# EAGLE design RGB-driver-v1 (EAGLE 7.1.0)
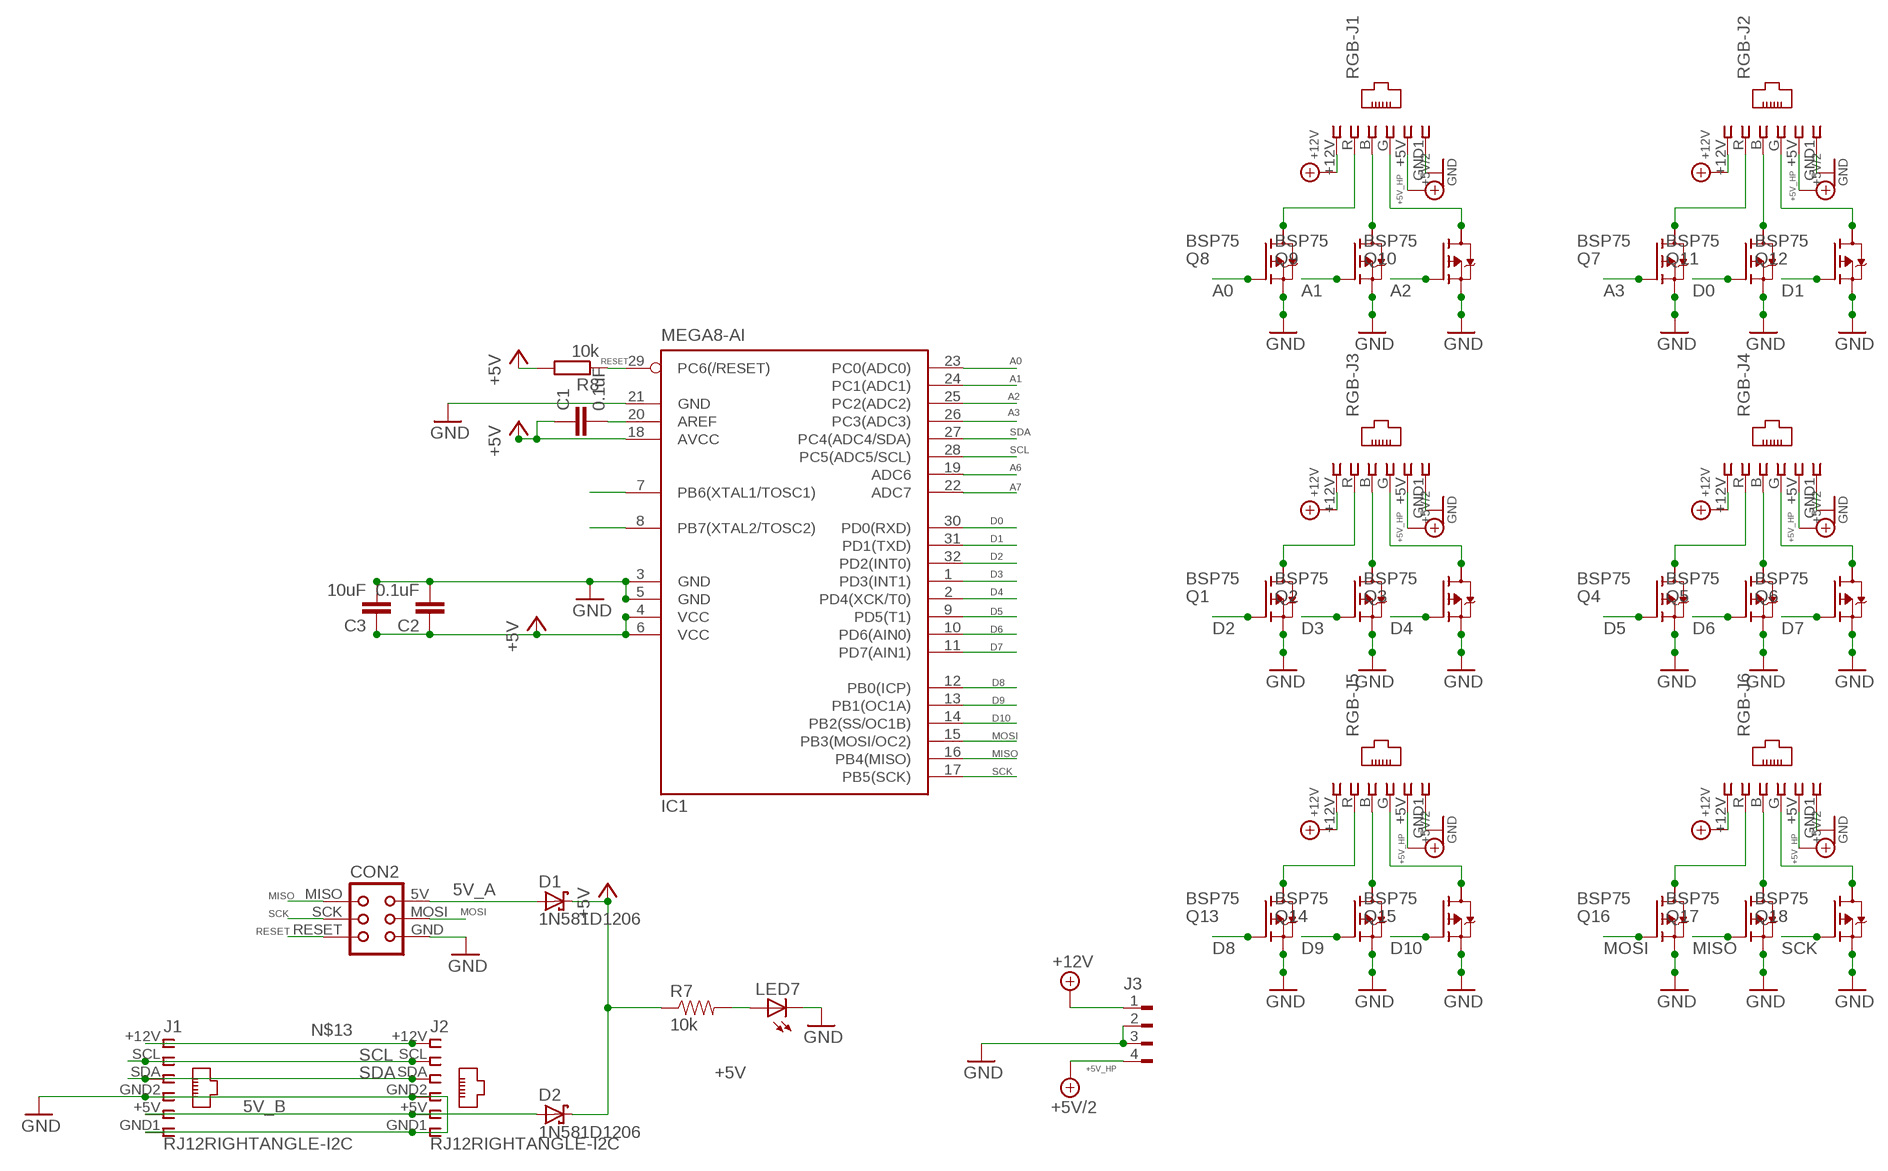
[diagram p0: schematic, sheet 1]

## Parts
C1  0.1uF  C-EUC1206  [C1206]
C2  0.1uF  C-EUC1206  [C1206]
C3  10uF  C-EUC1206  [C1206]
CON2  TINYISPTAG  [TC2030-MCP]
D1  1N581D1206  [LED-1206]
D2  1N581D1206  [LED-1206]
IC1  MEGA8-AI  [TQFP32-08]
J1  RJ12RIGHTANGLE-I2C  [RJ12-RIGHTANGLE-I2C]
J2  RJ12RIGHTANGLE-I2C  [RJ12-RIGHTANGLE-I2C]
J3  FLOP-4W827001  [827001]
LED7  LEDCHIP-LED0603  [CHIP-LED0603]
Q1  BSP75  BSP613P  [PG-SOT-223]
Q2  BSP75  BSP613P  [PG-SOT-223]
Q3  BSP75  BSP613P  [PG-SOT-223]
Q4  BSP75  BSP613P  [PG-SOT-223]
Q5  BSP75  BSP613P  [PG-SOT-223]
Q6  BSP75  BSP613P  [PG-SOT-223]
Q7  BSP75  BSP613P  [PG-SOT-223]
Q8  BSP75  BSP613P  [PG-SOT-223]
Q9  BSP75  BSP613P  [PG-SOT-223]
Q10  BSP75  BSP613P  [PG-SOT-223]
Q11  BSP75  BSP613P  [PG-SOT-223]
Q12  BSP75  BSP613P  [PG-SOT-223]
Q13  BSP75  BSP613P  [PG-SOT-223]
Q14  BSP75  BSP613P  [PG-SOT-223]
Q15  BSP75  BSP613P  [PG-SOT-223]
Q16  BSP75  BSP613P  [PG-SOT-223]
Q17  BSP75  BSP613P  [PG-SOT-223]
Q18  BSP75  BSP613P  [PG-SOT-223]
R7  10k  RESISTOR0603-RES  [0603-RES]
R8  10k  R-EU_M1206  [M1206]
RGB-J1  RJ12  RJ12STRAIGHT-RGB  [RJ12-STRAIGHT-RGB]
RGB-J2  RJ12  RJ12STRAIGHT-RGB  [RJ12-STRAIGHT-RGB]
RGB-J3  RJ12  RJ12STRAIGHT-RGB  [RJ12-STRAIGHT-RGB]
RGB-J4  RJ12  RJ12STRAIGHT-RGB  [RJ12-STRAIGHT-RGB]
RGB-J5  RJ12  RJ12STRAIGHT-RGB  [RJ12-STRAIGHT-RGB]
RGB-J6  RJ12  RJ12STRAIGHT-RGB  [RJ12-STRAIGHT-RGB]

## Nets
5V_A [i2c]: CON2.5V(VCC) D1.A
5V_B [power]: D2.A J1.+5V J2.+5V
+5V [power]: C1.1 C2.1 C3.1 D1.C D2.C IC1.4(VCC) IC1.6(VCC) IC1.18(AVCC) R7.1 R8.2
+5V_HP [power]: J3.4 RGB-J1.+5V RGB-J2.+5V RGB-J3.+5V RGB-J4.+5V RGB-J5.+5V RGB-J6.+5V ; supply symbol labelled +5V/2
+12V_HP [power]: J3.1 RGB-J1.+12V RGB-J2.+12V RGB-J3.+12V RGB-J4.+12V RGB-J5.+12V RGB-J6.+12V ; supply symbol labelled +12V
A0: IC1.23(PC0(ADC0)) Q8.1(G)
A1: IC1.24(PC1(ADC1)) Q9.1(G)
A2: IC1.25(PC2(ADC2)) Q10.1(G)
A3: IC1.26(PC3(ADC3)) Q7.1(G)
A6: IC1.19(ADC6)
A7: IC1.22(ADC7)
D0: IC1.30(PD0(RXD)) Q11.1(G)
D1: IC1.31(PD1(TXD)) Q12.1(G)
D2: IC1.32(PD2(INT0)) Q1.1(G)
D3: IC1.1(PD3(INT1)) Q2.1(G)
D4: IC1.2(PD4(XCK/T0)) Q3.1(G)
D5: IC1.9(PD5(T1)) Q4.1(G)
D6: IC1.10(PD6(AIN0)) Q5.1(G)
D7: IC1.11(PD7(AIN1)) Q6.1(G)
D8: IC1.12(PB0(ICP)) Q13.1(G)
D9: IC1.13(PB1(OC1A)) Q14.1(G)
D10: IC1.14(PB2(SS/OC1B)) Q15.1(G)
GND [power]: C2.2 C3.2 CON2.GND IC1.3(GND) IC1.5(GND) IC1.21(GND) J1.GND1 J1.GND2 J2.GND1 J2.GND2 J3.2 J3.3 LED7.C Q1.3(S) Q2.3(S) Q3.3(S) Q4.3(S) Q5.3(S) Q6.3(S) Q7.3(S) Q8.3(S) Q9.3(S) Q10.3(S) Q11.3(S) Q12.3(S) Q13.3(S) Q14.3(S) Q15.3(S) Q16.3(S) Q17.3(S) Q18.3(S) RGB-J1.GND1 RGB-J2.GND1 RGB-J3.GND1 RGB-J4.GND1 RGB-J5.GND1 RGB-J6.GND1
MISO: CON2.MISO IC1.16(PB4(MISO)) Q17.1(G)
MOSI: CON2.MOSI IC1.15(PB3(MOSI/OC2)) Q16.1(G)
N$1: Q2.2(D) RGB-J3.B
N$2 [aref]: Q1.2(D) RGB-J3.R
N$3 [aref]: Q3.2(D) RGB-J3.G
N$4: C1.2 IC1.20(AREF)
N$5 [aref]: Q5.2(D) RGB-J4.B
N$6 [aref]: Q10.2(D) RGB-J1.G
N$7 [aref]: Q4.2(D) RGB-J4.R
N$8 [aref]: Q6.2(D) RGB-J4.G
N$9 [aref]: Q14.2(D) RGB-J5.B
N$10: Q11.2(D) RGB-J2.B
N$11 [aref]: Q13.2(D) RGB-J5.R
N$12 [aref]: Q15.2(D) RGB-J5.G
N$13: J1.+12V J2.+12V
N$14 [aref]: Q17.2(D) RGB-J6.B
N$15: LED7.A R7.2
N$16 [aref]: Q16.2(D) RGB-J6.R
N$17 [aref]: Q18.2(D) RGB-J6.G
N$20 [aref]: Q7.2(D) RGB-J2.R
N$23 [aref]: Q12.2(D) RGB-J2.G
N$50 [aref]: Q9.2(D) RGB-J1.B
N$68 [aref]: Q8.2(D) RGB-J1.R
PB6: IC1.7(PB6(XTAL1/TOSC1))
PB7: IC1.8(PB7(XTAL2/TOSC2))
RESET: CON2.RESET IC1.29(PC6(/RESET)) R8.1
SCK: CON2.SCK IC1.17(PB5(SCK)) Q18.1(G)
SCL [i2c]: IC1.28(PC5(ADC5/SCL)) J1.SCL J2.SCL
SDA [i2c]: IC1.27(PC4(ADC4/SDA)) J1.SDA J2.SDA
Unconnected: Q1.4(D) Q2.4(D) Q3.4(D) Q4.4(D) Q5.4(D) Q6.4(D) Q7.4(D) Q8.4(D) Q9.4(D) Q10.4(D) Q11.4(D) Q12.4(D) Q13.4(D) Q14.4(D) Q15.4(D) Q16.4(D) Q17.4(D) Q18.4(D)

## Library data of the parts
C1-C3 = resistor:C-EU: CAPACITOR, European symbol
CON2 = lpatiny:TINYISP: CONNECTOR
D1 D2 = lpatiny:1N581*: 1.0A SCHOTTKY BARRIER RECTIFIER Source: http://www.diodes.com/datasheets/ds23001.pdf
IC1 = atmel:MEGA8: MICROCONTROLLER 8 Kbytes FLASH, 1 kbytes SRAM, 512 bytes EEPROM, USART, 6-channel 10 bit ADC, 2-channel 8 bit ADC Pin compatible with Atmega48, ATMega88, ATMega168 Source: avr.lbr; MPN: ATMEGA8-16AU; OC_FARNELL: 9171371; OC_NEWARK: 73M8863
J1 J2 RGB-J1-RGB-J6 = lpatiny:RJ12: CORCOM Modular RJ Jacks No Shield Source: www.tycoelectronics.com .. ENG_DS_1654001_1099_RJ_L_0507.pdf
J3 = con-amp:FLOP-4W: MATE N-LOCK Floppy / HDD conector Distributor: Bürklin 71F972
LED7 = adafruit:LED: LED OSRAM: - CHIPLED LG R971, LG N971, LY N971, LG Q971, LY Q971, LO R971, LY R971 LH N974, LH R974 LS Q976, LO Q976, LY Q976 LO Q996 - Hyper CHIPLED LW Q18S LB Q993, LB Q99A, LB R99A - SideLED LS A670, LO A670, LY A670, LG A670, LP A670 LB A673, LV A673, LT A673, LW A673 LH A674 LY A675 LS A676, LA A676, LO A676, LY A676, LW A676 LS A679, LY A679, LG A679 - Hyper Micro SIDELED® LS Y876, LA Y876, LO Y876, LY Y876 LT Y87S - SmartLED LW L88C, LW L88S LB L89C, LB L89S, LG L890 LS L89K, LO L89K, LY L89K LS L896, LA L896, LO L896, LY L896 - TOPLED LS T670, LO T670, LY T670, LG T670, LP T670 LSG T670, LSP T670, LSY T670, LOP T670, LYG T670 LG T671, LOG T671, LSG T671 LB T673, LV T673, LT T673, LW T673 LH T674 LS T676, LA T676, LO T676, LY T676, LB T676, LH T676, LSB T676, LW T676 LB T67C, LV T67C, LT T67C, LS T67K, LO T67K, LY T67K, LW E67C LS E67B, LA E67B, LO E67B, LY E67B, LB E67C, LV E67C, LT E67C LW T67C LS T679, LY T679, LG T679 LS T770, LO T770, LY T770, LG T770, LP T770 LB T773, LV T773, LT T773, LW T773 LH T774 LS E675, LA E675, LY E675, LS T675 LS T776, LA T776, LO T776, LY T776, LB T776 LHGB T686 LT T68C, LB T68C - Hyper Mini TOPLED® LB M676 - Mini TOPLED Santana® LG M470 LS M47K, LO M47K, LY M47K Source: http://www.osram.convergy.de/
Q1-Q18 = infineon:BSP613P: SIPMOS (R) Small-Signal-Transistor P-Channel (2 Drain) Source: http://www.infineon.com/dgdl/BSP613P_Rev2.4.pdf; OC_FARNELL: unknown; OC_NEWARK: unknown
R7 = SparkFun:RESISTOR: Resistor Basic schematic elements and footprints for 0603, 1206, and PTH resistors.
R8 = resistor:R-EU_: RESISTOR, European symbol

## Net classes
0 default: width 0.406 mm
1 power: width 0.457 mm
2 i2c: width 0.457 mm
3 fine: width 0.305 mm
4 aref: width 0.406 mm

## Board
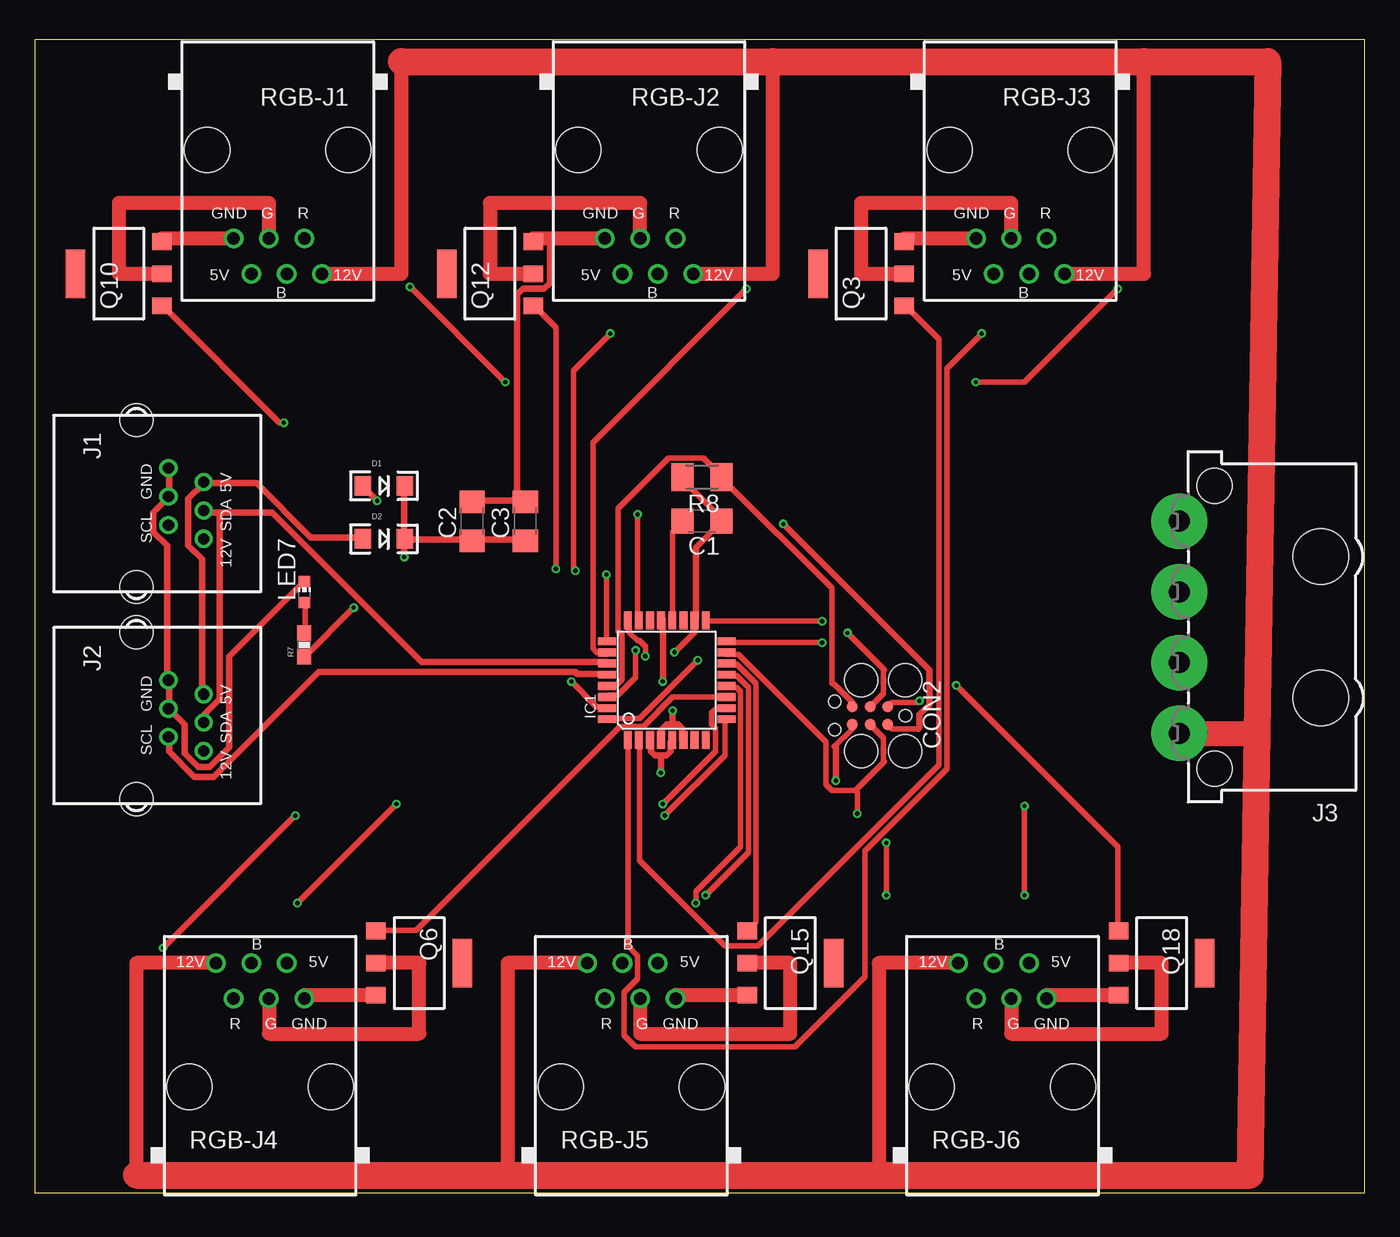
[diagram p1: board, top side]
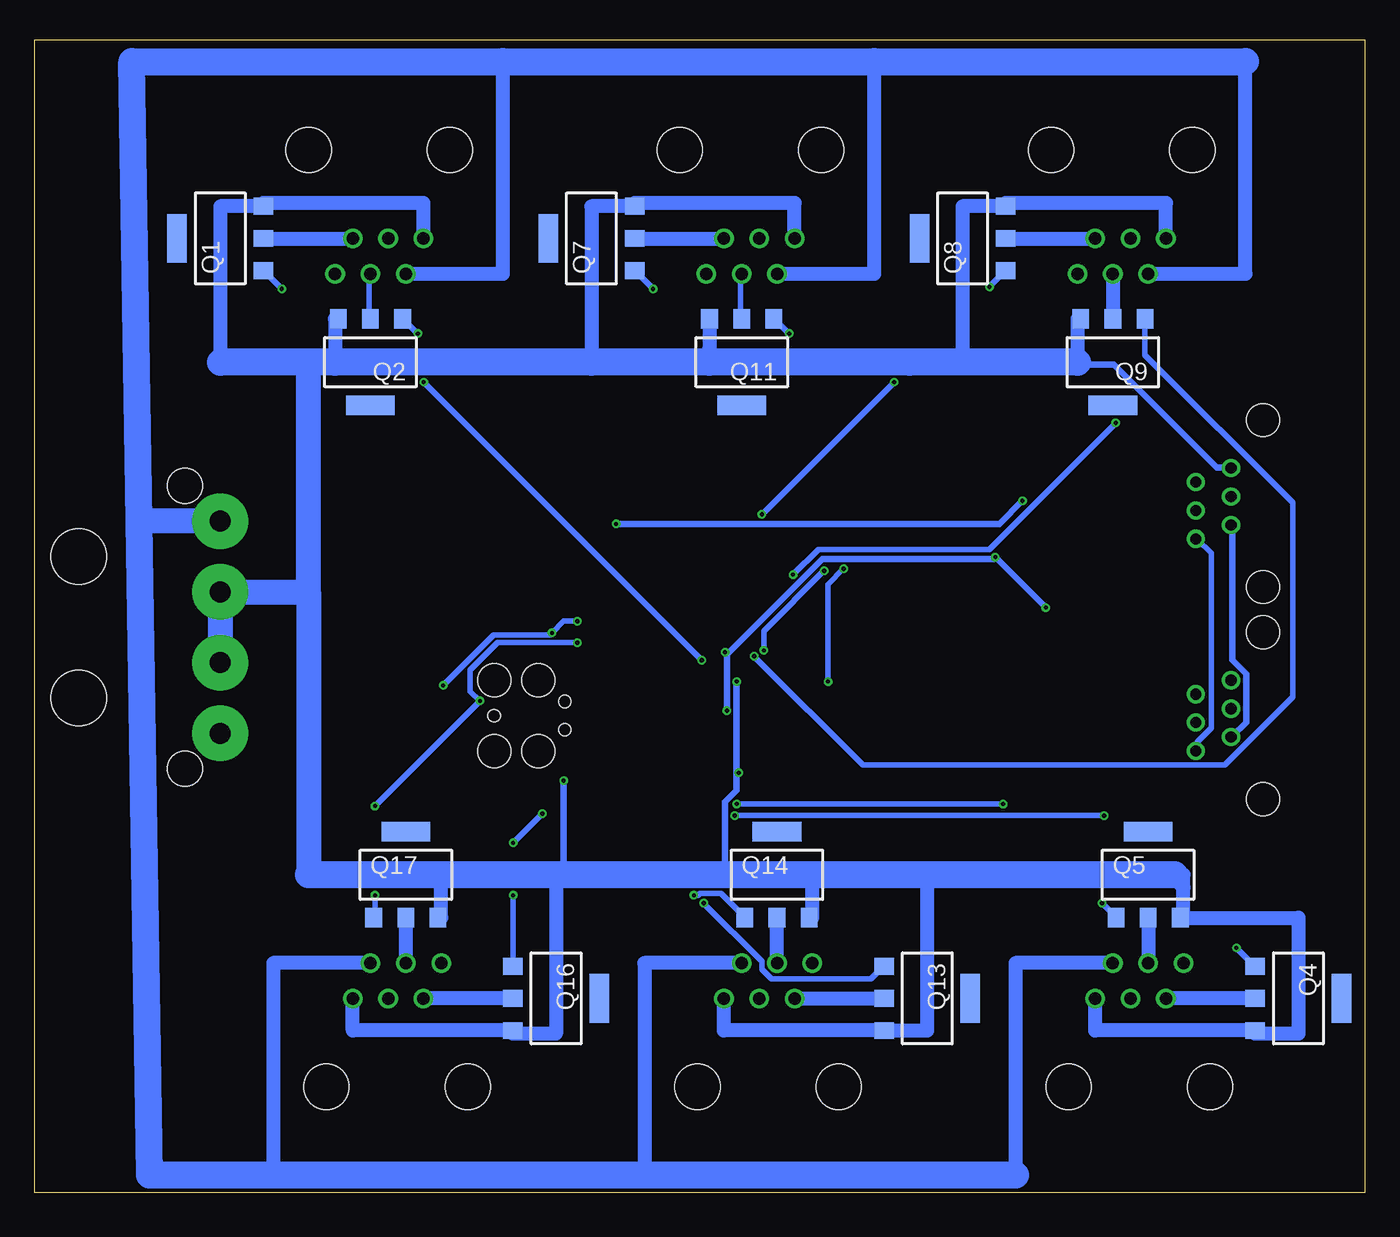
[diagram p2: board, bottom side, seen from below]

Size 95.56 x 82.86 mm. Coordinates in mm from the lower left corner, seen from the top.
Outline: 0,0 95.56,0 95.56,82.86 0,82.86 0,0
Copper layers (1*16): Top 0.035mm / dielectric 1.5mm / Bottom 0.035mm
Design rules "default": minimum track width 6mil, minimum drill 12mil, track to track 6mil, track to pad 6mil, pad to pad 6mil, via to via 6mil, smd to smd 0mil, copper to edge 10mil, drill to drill 10mil, minimum pad ring 10mil, minimum via ring 6mil, stop-mask expansion 2mil, vias tented up to drill 100mil, thermal gap 10mil
vRestrict: area 39.1,30.5 to 51.8,34.3; area 39.1,39.4 to 51.8,43.2; area 47.9,30.5 to 51.8,43.2; area 39.1,30.5 to 42.9,43.2; area 56.8,31.8 to 61.9,36.8

### Footprints (pad centres in the part's own frame; a part is rotated, then mirrored left to right if it is on the bottom)
C1206 = smd 1.6 x 1.8: 1 -1.4,0; 2 1.4,0
TC2030-MCP = smd 0.787 x 0.787: 5V 1.27,0.635; GND 3.81,0.635; MISO 1.27,-0.635; MOSI 2.54,0.635; RESET 3.81,-0.635; SCK 2.54,-0.635 | hole 0.889: 0,0; 5.08,-1.016; 5.08,1.016 | hole 2.375: 0,2.54; 0,-2.54; 3.175,-2.54; 3.175,2.54
LED-1206 = smd 1.2 x 1.4: A -1.5,0; C 1.5,0
TQFP32-08 = smd 1.27 x 0.559: 1 -4.293,2.8; 2 -4.293,2; 3 -4.293,1.2; 4 -4.293,0.4; 5 -4.293,-0.4; 6 -4.293,-1.2; 7 -4.293,-2; 8 -4.293,-2.8; 17 4.293,-2.8; 18 4.293,-2; 19 4.293,-1.2; 20 4.293,-0.4; 21 4.293,0.4; 22 4.293,1.2; 23 4.293,2; 24 4.293,2.8 | smd 0.559 x 1.27: 9 -2.8,-4.293; 10 -2,-4.293; 11 -1.2,-4.293; 12 -0.4,-4.293; 13 0.4,-4.293; 14 1.2,-4.293; 15 2,-4.293; 16 2.8,-4.293; 25 2.8,4.293; 26 2,4.293; 27 1.2,4.293; 28 0.4,4.293; 29 -0.4,4.293; 30 -1.2,4.293; 31 -2,4.293; 32 -2.8,4.293
RJ12-RIGHTANGLE-I2C = drill 0.8 pad 1.3: +5V -1.54,4.84; +12V 2.54,4.84; GND1 -2.54,2.3; GND2 -0.5,2.3; SCL 1.54,2.3; SDA 0.5,4.84 | hole 2.36: -6,0; 6,0
827001 = drill 1.5 pad 4: 1 -7.62,0; 2 -2.54,0; 3 2.54,0; 4 7.62,0 | hole 4: 5.08,-10.16; -5.08,-10.16 | hole 2.5: 10.16,-2.54; -10.16,-2.54
CHIP-LED0603 = smd 0.8 x 0.8: A 0,-0.75; C 0,0.75
PG-SOT-223 = smd 1.2 x 1.4: 1 -2.311,-3.099; 2 0,-3.099; 3 2.311,-3.099 | smd 3.5 x 1.4: 4 0,3.099
0603-RES = smd 1.1 x 1: 1 -0.85,0; 2 0.85,0
M1206 = smd 1.6 x 2: 1 -1.4,0; 2 1.4,0
RJ12-STRAIGHT-RGB = drill 0.9 pad 1.4: +5V 1.905,8.89; +12V -3.175,8.89; B -0.635,8.89; G 0.635,6.35; GND1 3.175,6.35; R -1.905,6.35 | hole 3.251: -5.08,0; 5.08,0

### Placement (x,y rotation side)
C1  47.94,48.26 180 top
C2  31.43,48.26 90 top
C3  35.24,48.26 90 top
CON2  62.55,34.29 180 top
D1  25.08,50.8 0 top
D2  25.08,46.99 0 top
IC1  45.4,36.83 90 top
J1  7.3,49.53 270 top
J2  7.3,34.29 270 top
J3  82.23,40.64 90 top
LED7  19.37,43.18 0 top
Q1  82.23,68.58 90 bottom
Q2  71.44,59.69 180 bottom
Q3  59.37,66.04 90 top
Q4  4.76,13.97 270 bottom
Q5  15.56,22.86 0 bottom
Q6  27.62,16.51 270 top
Q7  55.56,68.58 90 bottom
Q8  28.89,68.58 90 bottom
Q9  18.1,59.69 180 bottom
Q10  6.03,66.04 90 top
Q11  44.77,59.69 180 bottom
Q12  32.7,66.04 90 top
Q13  31.43,13.97 270 bottom
Q14  42.23,22.86 0 bottom
Q15  54.29,16.51 270 top
Q16  58.1,13.97 270 bottom
Q17  68.9,22.86 0 bottom
Q18  80.96,16.51 270 top
R7  19.37,39.37 90 top
R8  47.94,51.44 180 top
RGB-J1  17.46,74.93 180 top
RGB-J2  44.13,74.93 180 top
RGB-J3  70.8,74.93 180 top
RGB-J4  16.19,7.62 0 top
RGB-J5  42.86,7.62 0 top
RGB-J6  69.53,7.62 0 top

### Tracks (layer width: path | path; a pad name or v marks a point on that pad's centre or on a via)
5V_A  (via drill 0.3)
  Top 0.406: CON2.5V 61.59,33.34 63.5,33.34
  Top 0.457: v53.78,48.06 64.26,37.58 64.26,35.06 63.56,34.37 63.56,33.53 63.5,33.34 | v24.59,49.73 23.61,50.71 D1.A
  Bottom 0.457: v53.78,48.06 26.26,48.06 v24.59,49.73
5V_B
  Top 0.457: D2.A 23.47,47.08 19.84,47.08 15.93,50.99 12.15,50.99 J1.+5V 12.01,50.85 11.04,49.87 11.04,46.52 12.01,45.54 12.01,35.9 J2.+5V
+5V  (via drill 0.3)
  Top 0.457: R8.2 46.66,51.41 46.66,51.13 49.31,48.48 C1.1 49.31,48.2 47.5,46.38 47.5,41.21 IC1.18 47.36,40.93 47.36,40.23 v45.96,38.84 | C3.1 35.2,46.94 31.43,46.94 C2.1 31.29,46.94 26.68,46.94 D2.C | 45.82,33.67 46.24,33.67 46.52,33.39 46.52,32.55 IC1.6 | 45.82,33.67 45.4,33.67 44.98,33.25 44.98,32.55 IC1.4 | v22.91,42.05 19.42,38.56 R7.1 | v26.54,45.68 26.54,46.94 D2.C | D1.C 26.54,50.71 26.54,47.08 D2.C | v45.82,34.65 45.82,33.67
  Bottom 0.457: v22.91,42.05 v26.54,45.68 26.68,45.54 38.98,45.54 45.82,38.7 | 45.82,38.7 v45.82,34.65 | v45.96,38.84 45.82,38.7
+5V_HP
  Bottom 1.016: RGB-J1.+5V 8.57,66.04 8.57,81.28 | RGB-J2.+5V 35.24,66.04 35.24,81.28 | RGB-J3.+5V 61.91,66.04 61.91,81.28 | RGB-J6.+5V 78.42,16.51 78.42,1.27 | RGB-J5.+5V 51.75,16.51 51.75,1.27 | RGB-J4.+5V 25.08,16.51 25.08,1.27
  Bottom 1.778: J3.4 88.06,48.26 88.06,48.25
  Bottom 1.93: 25.08,1.27 51.75,1.27 78.42,1.27 87.31,1.27 88.06,48.25 88.58,81.28 61.91,81.28 35.24,81.28 8.57,81.28
+12V_HP
  Top 1.016: RGB-J1.+12V 26.35,66.04 26.35,81.28 | RGB-J2.+12V 53.02,66.04 53.02,81.28 | RGB-J3.+12V 79.69,66.04 79.69,81.28 | RGB-J4.+12V 7.3,16.51 7.3,1.27 | RGB-J5.+12V 33.97,16.51 33.97,1.27 | RGB-J6.+12V 60.64,16.51 60.64,1.27
  Top 1.778: J3.1 87.82,33.02 87.82,33.01
  Top 1.93: 26.35,81.28 53.02,81.28 79.69,81.28 88.58,81.28 87.82,33.01 87.31,1.27 60.64,1.27 33.97,1.27 7.3,1.27
A0  (via drill 0.3)
  Top 0.406: v43.31,48.76 43.31,41.21 IC1.23 | v26.96,65.1 v33.81,58.26
  Bottom 0.406: v33.81,58.26 v43.31,48.76 | v26.96,65.1 25.84,66.22 Q8.1
A1  (via drill 0.3)
  Top 0.406: v43.87,38.56 43.87,39.26 43.45,39.67 43.31,39.67 42.75,40.23 42.75,40.37 42.61,40.51 42.61,41.07 IC1.24
  Bottom 0.406: v43.87,38.56 36.04,30.73 10.06,30.73 5.17,35.62 5.17,49.59 15.79,60.21 15.79,62.73 Q9.1
A2  (via drill 0.3)
  Top 0.406: v41.07,44.42 41.07,39.67 IC1.25 | v17.88,55.32 17.6,55.32 9.22,63.7 Q10.1
  Bottom 0.406: v41.07,44.42 39.26,46.24 26.96,46.24 v17.88,55.32
A3  (via drill 0.3)
  Top 0.406: v51.13,64.96 40.09,53.92 40.09,39.12 40.37,38.84 41.07,38.84 IC1.26
  Bottom 0.406: v51.13,64.96 52.39,66.22 Q7.1
D0  (via drill 0.3)
  Top 0.406: v43.17,38.98 43.17,37.02 41.91,35.76 41.21,35.76 IC1.30 | v38.84,44.7 38.84,44.84 38.7,44.98 38.7,59.09 v41.35,61.75
  Bottom 0.406: v43.17,38.98 43.17,40.37 v38.84,44.7 | v41.35,61.75 42.33,62.73 Q11.1
D1  (via drill 0.3)
  Top 0.406: v38.56,36.74 40.37,34.92 41.07,34.92 IC1.31 | v37.44,44.84 37.44,62.17 35.9,63.7 Q12.1
  Bottom 0.406: v38.56,36.74 38.56,43.73 v37.44,44.84
D2  (via drill 0.3)
  Top 0.406: v47.64,38.28 43.45,34.09 41.21,34.09 IC1.32 | v67.61,58.26 71.11,58.26 v77.81,64.96
  Bottom 0.406: v67.61,58.26 v47.64,38.28 | v77.81,64.96 79.07,66.22 Q1.1
D3  (via drill 0.3)
  Top 0.406: v68.03,61.75 65.52,59.23 65.52,30.45 59.65,24.59 59.65,15.51 54.62,10.48 43.17,10.48 42.33,11.32 42.33,14.39 43.31,15.37 43.31,17.04 42.61,17.74 42.61,32.41 IC1.1
  Bottom 0.406: v68.03,61.75 69.01,62.73 Q2.1
D4
  Top 0.406: IC1.2 43.45,32.41 43.45,23.89 49.59,17.74 51.97,17.74 64.96,30.73 64.96,61.33 62.59,63.7 Q3.1
D5  (via drill 0.3)
  Top 0.406: v45.26,27.1 49.59,31.43 49.59,33.95 IC1.9 | v9.22,17.6 v18.72,27.1
  Bottom 0.406: v18.72,27.1 v45.26,27.1 | v9.22,17.6 7.96,16.34 Q4.1
D6  (via drill 0.3)
  Top 0.406: v45.12,27.94 48.9,31.71 48.9,33.39 48.62,33.67 48.62,34.51 48.9,34.78 49.59,34.78 IC1.10 | v18.86,20.82 v25.98,27.94
  Bottom 0.406: v25.98,27.94 v45.12,27.94 | v18.86,20.82 17.88,19.84 Q5.1
D7
  Top 0.406: IC1.11 49.59,35.62 45.82,35.62 43.73,33.53 42.05,33.53 27.38,18.86 24.59,18.86 Q6.1
D8  (via drill 0.3)
  Top 0.406: v47.5,20.82 47.5,21.65 50.71,24.87 50.71,36.04 50.43,36.32 49.73,36.32 IC1.12
  Bottom 0.406: v47.5,20.82 43.31,16.62 43.31,16.07 42.61,15.37 35.48,15.37 34.65,16.2 Q13.1
D9  (via drill 0.3)
  Top 0.406: v48.2,21.37 51.27,24.45 51.27,36.32 50.43,37.16 49.73,37.16 IC1.13
  Bottom 0.406: v48.2,21.37 47.92,21.37 47.78,21.51 46.24,21.51 44.56,19.84 Q14.1
D10
  Top 0.406: IC1.14 49.73,38 50.43,38 51.83,36.6 51.83,19.42 51.27,18.86 Q15.1
GND  (via drill 0.3)
  Top 0.406: CON2.GND 58.74,33.34 57.47,32.07
  Top 0.457: LED7.C 19.28,43.87 13.97,38.56 13.97,31.99 12.57,30.59 11.73,30.59 10.76,31.57 10.76,33.67 9.64,34.78 J2.GND2 9.64,34.92 9.64,36.74 J2.GND1 9.5,37.02 9.5,46.52 8.52,47.5 8.52,48.9 9.5,49.87 J1.GND2 9.64,50.15 9.64,51.97 J1.GND1 | C2.2 31.43,49.73 35.2,49.73 C3.2 34.65,49.87 34.65,64.54 35.06,64.96 36.6,64.96 37.02,65.38 37.02,68.58 | 44.98,31.43 45.4,31.43 45.68,31.71 45.68,32.41 IC1.5 45.82,32.55 | 44.98,31.43 44.56,31.43 44.28,31.71 44.28,32.41 IC1.3 | 45.12,41.21 IC1.21 45.12,40.93 v45.12,36.74 | v57.56,29.62 57.56,31.99 57.47,32.07 | v44.98,30.18 44.98,31.43
  Top 1.016: Q15.3 46.04,14.2 RGB-J5.GND1 | RGB-J1.GND1 9.13,68.58 Q10.3 | RGB-J2.GND1 37.02,68.58 35.8,68.58 Q12.3 | RGB-J3.GND1 62.47,68.58 Q3.3 | Q6.3 19.37,14.2 RGB-J4.GND1 | Q18.3 72.71,14.2 RGB-J6.GND1
  Bottom 0.457: 45.12,30.18 45.12,28.92 45.96,28.08 45.96,22.86 | 45.12,30.18 v45.12,36.74 | Q9.3 20.4,62.87 20.64,62.79 | 57.56,22.86 v57.56,29.62 | v44.98,30.18 45.12,30.18 | 47.08,60.63 47.08,59.69 | J1.GND1 9.64,52.11 10.62,52.11 18.02,59.51 19.7,59.51 20.64,59.69 | 13.02,21.93 13.41,21.93 13.65,22.86
  Bottom 1.016: RGB-J5.GND1 46.04,11.66 Q13.3 31.43,11.66 31.43,22.86 | RGB-J4.GND1 19.37,11.66 Q4.3 7.86,11.43 4.76,11.43 4.76,19.76 Q5.3 13.02,19.76 13.02,21.93 13.02,22.86 | RGB-J6.GND1 72.71,11.66 Q16.3 61.2,11.43 58.1,11.43 58.1,22.86 | RGB-J1.GND1 14.29,71.12 25.79,71.12 Q8.3 28.89,70.89 28.89,59.69 32.7,59.69 | 46.67,59.69 47.08,60.1 47.08,60.63 Q11.3 | Q2.3 73.98,62.79 73.98,59.69 | 82.23,59.69 82.23,70.89 Q1.3 79.13,71.12 67.63,71.12 RGB-J3.GND1 | 55.56,59.69 55.56,70.89 Q7.3 52.46,71.12 40.96,71.12 RGB-J2.GND1 | Q14.3 39.69,19.76 39.69,22.86 | Q17.3 66.36,19.76 66.36,22.86 | 20.64,62.79 20.64,59.69
  Bottom 1.778: J3.2 J3.3 75.88,43.18 | 75.88,43.18 75.88,22.86 66.99,22.86 | 75.88,43.18 75.88,59.69
  Bottom 1.93: 20.64,59.69 32.7,59.69 47.08,59.69 55.56,59.69 73.98,59.69 75.88,59.69 82.23,59.69 | 13.65,22.86 31.43,22.86 39.69,22.86 45.96,22.86 57.56,22.86 58.1,22.86 66.36,22.86 75.88,22.86
MISO  (via drill 0.3)
  Top 0.406: CON2.MISO 61.59,35.24 63.5,35.24 v63.56,35.34 | v56.58,39.53 49.73,39.53 IC1.16 | v71.11,27.8 v71.11,21.37
  Bottom 0.406: v56.58,39.53 62.31,39.53 64.26,37.58 64.26,36.04 v63.56,35.34 v71.11,27.8 | v71.11,21.37 71.11,19.84 Q17.1
MOSI  (via drill 0.3)
  Top 0.406: CON2.MOSI 60.96,32.7 60.96,31.11 61.05,31.01 58.95,28.92 | 58.95,28.92 57.28,28.92 56.86,29.34 56.86,32.41 50.57,38.7 49.73,38.7 IC1.15 | v61.19,25.15 v61.19,21.37 | v59.09,27.24 59.09,28.78 58.95,28.92
  Bottom 0.406: v61.19,21.37 61.19,16.34 Q16.1 | v59.09,27.24 v61.19,25.15
N$1
  Bottom 0.406: Q2.2 71.53,62.87 71.53,65.94 RGB-J3.B
N$2
  Bottom 1.016: Q1.2 RGB-J3.R
N$3
  Top 1.016: RGB-J3.G 70.17,71.12 59.37,71.12 59.37,66.04 Q3.2
N$4
  Top 0.406: IC1.20 45.82,41.21 45.82,47.5 46.52,48.2 C1.2
N$5
  Bottom 1.016: Q5.2 RGB-J4.B
N$6
  Top 1.016: RGB-J1.G 16.83,71.12 6.03,71.12 6.03,66.04 Q10.2
N$7
  Bottom 1.016: Q4.2 RGB-J4.R
N$8
  Top 1.016: RGB-J4.G 16.83,11.43 27.62,11.43 27.62,16.51 Q6.2
N$9
  Bottom 1.016: RGB-J5.B Q14.2
N$10
  Bottom 0.406: Q11.2 44.84,62.87 44.84,65.94 RGB-J2.B
N$11
  Bottom 1.016: RGB-J5.R Q13.2
N$12
  Top 1.016: RGB-J5.G 43.5,11.43 54.29,11.43 54.29,16.51 Q15.2
N$13
  Bottom 0.406: J2.+12V 12.01,31.85 12.01,32.41 11.04,33.39 11.04,45.96 12.01,46.94 J1.+12V
N$14
  Bottom 1.016: Q17.2 RGB-J6.B
N$15
  Top 0.406: LED7.A 19.42,42.33 19.42,40.23 R7.2
N$16
  Bottom 1.016: Q16.2 RGB-J6.R
N$17
  Top 1.016: RGB-J6.G 70.17,11.43 80.96,11.43 80.96,16.51 Q18.2
N$20
  Bottom 1.016: Q7.2 RGB-J2.R
N$23
  Top 1.016: RGB-J2.G 43.5,71.12 32.7,71.12 32.7,66.04 Q12.2
N$50
  Bottom 1.016: RGB-J1.B Q9.2
N$68
  Bottom 1.016: Q8.2 RGB-J1.R
RESET
  Top 0.406: CON2.RESET 58.74,35.24 57.47,36.51 57.28,36.6 57.28,43.45 49.45,51.27 R8.1 49.31,51.55 48.06,52.81 45.54,52.81 41.91,49.17 41.91,40.37 42.19,40.09 42.19,36.88 41.77,36.46 41.21,36.46 IC1.29
SCK  (via drill 0.3)
  Top 0.406: CON2.SCK 60.96,35.88 60.96,37.47 61.05,37.58 v58.4,40.23 | v56.58,41.07 48.34,41.07 IC1.17 | v66.22,36.46 77.81,24.87 77.81,18.86 Q18.1
  Bottom 0.406: v56.58,41.07 57.56,41.07 v58.4,40.23 58.53,40.09 62.59,40.09 v66.22,36.46
SCL
  Top 0.457: IC1.28 41.07,37.3 38.98,37.3 38.84,37.44 20.4,37.44 12.85,29.9 11.46,29.9 9.64,31.71 9.64,32.69 J2.SCL
  Bottom 0.457: J1.SCL 9.5,47.92 9.5,38.28 8.52,37.3 8.52,33.81 9.5,32.83 J2.SCL
SDA
  Top 0.457: 13.27,48.9 12.15,48.9 J1.SDA | 13.27,48.9 17.04,48.9 27.8,38.14 41.07,38.14 IC1.27 | 13.27,48.9 13.27,35.48 12.15,34.37 12.15,33.81 J2.SDA

### Text on the board
tDocu: RGB High power V1